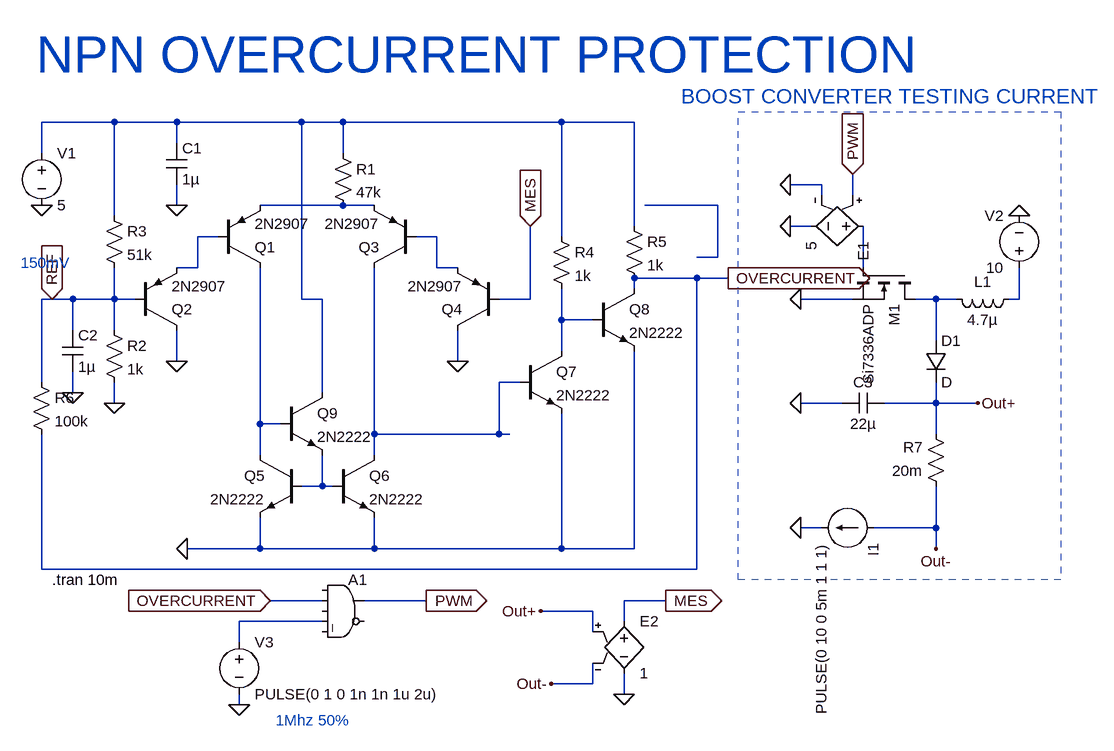
[diagram p0: schematic NpnOveccurentProtection.asc]
NpnOveccurentProtection.asc, the LTspice schematic file:
Version 4
SHEET 1 1756 680
WIRE -688 -800 -800 -800
WIRE -592 -800 -688 -800
WIRE -400 -800 -592 -800
WIRE -336 -800 -400 -800
WIRE 0 -800 -336 -800
WIRE 112 -800 0 -800
WIRE -592 -768 -592 -800
WIRE -800 -752 -800 -800
WIRE -336 -752 -336 -800
WIRE 400 -704 352 -704
WIRE 400 -688 400 -704
WIRE 448 -688 448 -720
WIRE -592 -672 -592 -704
WIRE -336 -672 -464 -672
WIRE -288 -672 -336 -672
WIRE 240 -672 128 -672
WIRE -688 -656 -688 -800
WIRE 112 -640 112 -800
WIRE 384 -640 352 -640
WIRE -528 -624 -560 -624
WIRE -192 -624 -224 -624
WIRE 0 -624 0 -800
WIRE 240 -592 240 -672
WIRE 240 -592 208 -592
WIRE -560 -576 -560 -624
WIRE -560 -576 -592 -576
WIRE -192 -576 -192 -624
WIRE -160 -576 -192 -576
WIRE 464 -576 464 -640
WIRE 208 -560 112 -560
WIRE 256 -560 208 -560
WIRE 112 -544 112 -560
WIRE -784 -528 -800 -528
WIRE -752 -528 -784 -528
WIRE -688 -528 -688 -576
WIRE -688 -528 -752 -528
WIRE -656 -528 -688 -528
WIRE -400 -528 -400 -800
WIRE -368 -528 -400 -528
WIRE -48 -528 -48 -640
WIRE -48 -528 -96 -528
WIRE 448 -528 368 -528
WIRE 576 -528 544 -528
WIRE 608 -528 576 -528
WIRE 704 -528 704 -576
WIRE 704 -528 688 -528
WIRE 0 -496 0 -544
WIRE 48 -496 0 -496
WIRE -752 -480 -752 -528
WIRE -688 -480 -688 -528
WIRE 576 -464 576 -528
WIRE 0 -448 0 -496
WIRE -592 -432 -592 -480
WIRE -160 -432 -160 -480
WIRE -800 -400 -800 -528
WIRE -64 -400 -96 -400
WIRE -752 -384 -752 -416
WIRE -368 -384 -368 -528
WIRE -688 -368 -688 -400
WIRE 432 -368 368 -368
WIRE 576 -368 576 -400
WIRE 576 -368 496 -368
WIRE 640 -368 576 -368
WIRE -464 -336 -464 -576
WIRE -432 -336 -464 -336
WIRE -288 -320 -288 -576
WIRE -96 -320 -96 -400
WIRE -96 -320 -288 -320
WIRE -80 -320 -96 -320
WIRE 576 -320 576 -368
WIRE -464 -288 -464 -336
WIRE -288 -288 -288 -320
WIRE -368 -240 -368 -288
WIRE -368 -240 -400 -240
WIRE -352 -240 -368 -240
WIRE 400 -176 368 -176
WIRE 576 -176 576 -240
WIRE 576 -176 480 -176
WIRE -464 -144 -464 -192
WIRE -464 -144 -576 -144
WIRE -288 -144 -288 -192
WIRE -288 -144 -464 -144
WIRE 0 -144 0 -352
WIRE 0 -144 -288 -144
WIRE 112 -144 112 -448
WIRE 112 -144 0 -144
WIRE 576 -144 576 -176
WIRE -800 -112 -800 -320
WIRE 208 -112 208 -560
WIRE 208 -112 -800 -112
WIRE -368 -64 -448 -64
WIRE -208 -64 -304 -64
WIRE 160 -64 96 -64
WIRE 48 -48 -32 -48
WIRE -368 -32 -496 -32
WIRE 96 -32 96 -64
WIRE 48 -16 48 -48
WIRE -496 0 -496 -32
WIRE 48 64 48 32
WIRE 48 64 -16 64
WIRE 96 80 96 48
WIRE -496 96 -496 80
FLAG -800 -672 0
FLAG -592 -672 0
FLAG -592 -432 0
FLAG -160 -432 0
FLAG -48 -640 MES
IOPIN -48 -640 In
FLAG -784 -528 REF
IOPIN -784 -528 In
FLAG -688 -368 0
FLAG -752 -384 0
FLAG -576 -144 0
FLAG 256 -560 OVERCURRENT
IOPIN 256 -560 Out
FLAG 368 -528 0
FLAG 352 -640 0
FLAG 352 -704 0
FLAG 448 -720 PWM
IOPIN 448 -720 In
FLAG 704 -656 0
FLAG 368 -368 0
FLAG 368 -176 0
FLAG 576 -144 Out-
FLAG 640 -368 Out+
FLAG -32 -48 Out+
FLAG -16 64 Out-
FLAG 96 80 0
FLAG 160 -64 MES
IOPIN 160 -64 Out
FLAG -496 96 0
FLAG -448 -64 OVERCURRENT
IOPIN -448 -64 In
FLAG -208 -64 PWM
IOPIN -208 -64 Out
SYMBOL pnp -528 -576 M180
SYMATTR InstName Q1
SYMATTR Value 2N2907
SYMBOL pnp -656 -480 M180
SYMATTR InstName Q2
SYMATTR Value 2N2907
SYMBOL pnp -224 -576 R180
SYMATTR InstName Q3
SYMATTR Value 2N2907
SYMBOL pnp -96 -480 R180
SYMATTR InstName Q4
SYMATTR Value 2N2907
SYMBOL res -352 -768 R0
SYMATTR InstName R1
SYMATTR Value 47k
SYMBOL voltage -800 -768 R0
SYMATTR InstName V1
SYMATTR Value 5
SYMBOL cap -608 -768 R0
SYMATTR InstName C1
SYMATTR Value 1µ
SYMBOL npn -400 -288 M0
SYMATTR InstName Q5
SYMATTR Value 2N2222
SYMBOL npn -352 -288 R0
SYMATTR InstName Q6
SYMATTR Value 2N2222
SYMBOL res -704 -496 R0
SYMATTR InstName R2
SYMATTR Value 1k
SYMBOL res -704 -672 R0
SYMATTR InstName R3
SYMATTR Value 51k
SYMBOL cap -768 -480 R0
SYMATTR InstName C2
SYMATTR Value 1µ
SYMBOL npn -64 -448 R0
SYMATTR InstName Q7
SYMATTR Value 2N2222
SYMBOL npn 48 -544 R0
SYMATTR InstName Q8
SYMATTR Value 2N2222
SYMBOL res -16 -640 R0
SYMATTR InstName R4
SYMATTR Value 1k
SYMBOL res 96 -656 R0
SYMATTR InstName R5
SYMATTR Value 1k
SYMBOL res -816 -416 R0
SYMATTR InstName R6
SYMATTR Value 100k
SYMBOL nmos 544 -576 R90
SYMATTR InstName M1
SYMATTR Value Si7336ADP
SYMBOL ind 704 -544 R90
WINDOW 0 5 56 VBottom 2
WINDOW 3 32 56 VTop 2
SYMATTR InstName L1
SYMATTR Value 4.7µ
SYMBOL e 480 -640 R90
SYMATTR InstName E1
SYMATTR Value 5
SYMBOL voltage 704 -560 R180
WINDOW 0 24 96 Left 2
WINDOW 3 24 16 Left 2
SYMATTR InstName V2
SYMATTR Value 10
SYMBOL diode 560 -464 R0
SYMATTR InstName D1
SYMBOL cap 496 -384 R90
WINDOW 0 0 32 VBottom 2
WINDOW 3 32 32 VTop 2
SYMATTR InstName C3
SYMATTR Value 22µ
SYMBOL current 480 -176 R90
WINDOW 123 0 0 Left 0
WINDOW 39 0 0 Left 0
SYMATTR InstName I1
SYMATTR Value PULSE(0 10 0 5m 1 1 1)
SYMBOL res 592 -224 R180
WINDOW 0 36 76 Left 2
WINDOW 3 36 40 Left 2
SYMATTR InstName R7
SYMATTR Value 20m
SYMBOL e 96 -48 R0
SYMATTR InstName E2
SYMATTR Value 1
SYMBOL Digital\\and -336 -112 R0
SYMATTR InstName A1
SYMBOL voltage -496 -16 R0
WINDOW 123 0 0 Left 0
WINDOW 39 0 0 Left 0
SYMATTR InstName V3
SYMATTR Value PULSE(0 1 0 1n 1n 1u 2u)
SYMBOL npn -432 -384 R0
SYMATTR InstName Q9
SYMATTR Value 2N2222
TEXT -832 -584 Left 2 ;150mV
TEXT -440 120 Left 2 ;1Mhz 50%
TEXT -784 -96 Left 2 !.tran 10m
TEXT -808 -904 Left 6 ;NPN OVERCURRENT PROTECTION
TEXT 184 -840 Left 3 ;BOOST CONVERTER TESTING CURRENT
RECTANGLE Normal 272 -816 768 -96 1

The netlist it stands for:
* NpnOveccurentProtection.asc
Q1 N011 N004 N002 0 2N2907
Q2 0 REF N004 0 2N2907
Q3 N010 N005 N002 0 2N2907
Q4 0 MES N005 0 2N2907
R1 N001 N002 47k
V1 N001 0 5
C1 N001 0 1µ
Q5 N011 N012 0 0 2N2222
Q6 N010 N012 0 0 2N2222
R2 REF 0 1k
R3 N001 REF 51k
C2 REF 0 1µ
Q7 N009 N010 0 0 2N2222
Q8 OVERCURRENT N009 0 0 2N2222
R4 N001 N009 1k
R5 N001 OVERCURRENT 1k
R6 REF OVERCURRENT 100k
M1 N007 N006 0 0 Si7336ADP
L1 N008 N007 4.7µ
E1 N006 0 PWM 0 5
V2 N008 0 10
D1 N007 Out+ D
C3 Out+ 0 22µ
I1 Out- 0 PULSE(0 10 0 5m 1 1 1)
R7 Out- Out+ 20m
E2 MES 0 Out+ Out- 1
A1 0 OVERCURRENT 0 N013 0 0 PWM 0 AND
V3 N013 0 PULSE(0 1 0 1n 1n 1u 2u)
Q9 N001 N011 N012 0 2N2222
.model D D
.lib standard.dio
.model NPN NPN
.model PNP PNP
.lib standard.bjt
.model NMOS NMOS
.model PMOS PMOS
.lib standard.mos
* 150mV
* 1Mhz 50%
.tran 10m
* NPN OVERCURRENT PROTECTION
* BOOST CONVERTER TESTING CURRENT
.backanno
.end